# Altium schematic sheet PowerSupply.SchDoc
size A4
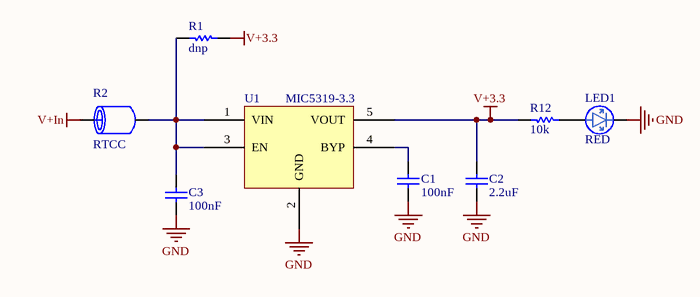
[diagram p0: PowerSupply.SchDoc]

## Parts
C1  100nF  [0603]
C2  2.2uF  [0805]
C3  100nF  [0603]
LED1  RED  [LED-0603-RED]
R1  dnp  [0603]
R2  RTCC  [0805]
R12  10k  [0603]
U1  MIC5319-3.3  [sot23-5]

## Nets
GND: C1.1 C2.1 C3.1 LED1.K U1.2(GND)
V+3.3: C2.2 R1.1 R12.2 U1.5(VOUT)
V+In: R2.1
NetC1_2: C1.2 U1.4(BYP)
NetC3_2: C3.2 R1.2 R2.2 U1.1(VIN) U1.3(EN)
NetLED1_A: LED1.A R12.1

## Library data of the parts
C1 C3 = Cap Semi: Capacitor (Semiconductor SIM Model); Published: 8-Jun-2000; LatestRevisionDate: 29-May-2009; LatestRevisionNote: IPC-7351 Footprint Added.; PackageReference: C1206; Publisher: Altium Limited; PackageDescription: Chip Capacitor; Value: 100nF
C2 = Cap Semi: Capacitor (Semiconductor SIM Model); Value: 100nF; Published: 8-Jun-2000; LatestRevisionDate: 29-May-2009; LatestRevisionNote: IPC-7351 Footprint Added.; PackageReference: C1206; Publisher: Altium Limited; PackageDescription: Chip Capacitor
LED1 = SMD_LED_0805
R1 R12 = Res Semi: Semiconductor Resistor; Value: 1M; Published: 8-Jun-2000; LatestRevisionDate: 17-Jul-2002; LatestRevisionNote: Re-released for DXP Platform.; PackageReference: AXIAL-0.5; Publisher: Altium Limited
R2 = Ferritbeat: Manufacturer: MURATA; Manufacturer Part Number: BLM18EG471SN1D; Supplier 1: Farnell; Supplier Part Number 1: 1515722; RoHS: YES; Stock 1: 11384; Pricing 1: 5=0,196, 50=0,17, 100=0,14, 250=0,112, 500=0,101, 2000=0,092 (EUR); ComponentLink1URL: http://www.farnell.com/datasheets/5169.pdf; ComponentLink1Description: http://www.farnell.com/datasheets/5169.pdf
U1 = MIC5305